# Altium project SmartHome_Switch_noAC.PrjPcb
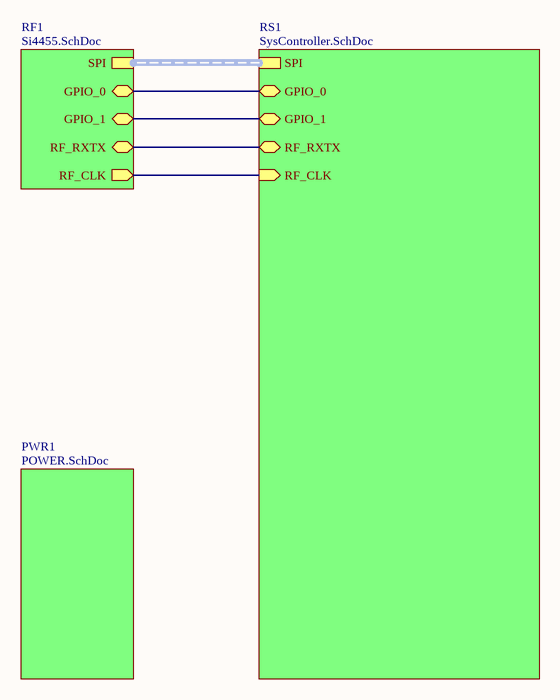
[diagram p0: main.SchDoc]
4 sheets, 74 parts. Net scope: hierarchical (ports join the sheet entries above them; power ports are global).
Board file: SmartHome_Switch.PcbDoc
Sheets:
  main.SchDoc
    PWR1 = POWER.SchDoc
    RS1 = SysController.SchDoc
    RF1 = Si4455.SchDoc

## Sheet main.SchDoc
size 209 x 297 mm; Address1: Address1; Address2: Address2; Address3: Address3; Address4: Address4; DocumentNumber: 1; SheetNumber: 1; SheetTotal: 7; Scale: 1:1; Обозначение документа: АБВГ.123456.001 Э3; Разраб.: Иванов; Пров.: Петров; Утв.: Сидоров; Наименование организации: ОАО "Ваша фирма"; Перв. применение: АБВГ.123456.000; Наименование изделия 1: Плата; Наименование изделия 2: Схема электрическая; Наименование изделия 3: принципиальная; Нач. отд.: Нач. отд.; Фамилия нач. отд.: Сидоров

### Sub-sheets
PWR1 = POWER.SchDoc: no entries
RF1 = Si4455.SchDoc: SPI (harness SPI), RF_RXTX (bidir), RF_CLK (out), GPIO_0 (bidir), GPIO_1 (bidir)
RS1 = SysController.SchDoc: RF_CLK (in), RF_RXTX (bidir), SPI (harness SPI), GPIO_0 (bidir), GPIO_1 (bidir)

### Nets
GPIO_0: sheet RS1/GPIO_0, sheet RF1/GPIO_0
GPIO_1: sheet RS1/GPIO_1, sheet RF1/GPIO_1
RF_CLK: sheet RS1/RF_CLK, sheet RF1/RF_CLK
RF_RXTX: sheet RS1/RF_RXTX, sheet RF1/RF_RXTX

### Buses and harness runs
harness sheet RF1/SPI = sheet RS1/SPI

### Notes on the sheet
- Перв. примен.
- Справ. №
- Подп. и дата
- Инв. № дубл.
- Взам. инв. №
- Разраб.
- Изм.
- Лист
- № докум.
- Подп.
- Дата
- Лит.
- Масса
- Масштаб
- Пров.
- Т.контр.
- Листов
- Инв. № подл.
- Утв.
- Н.контр.
- Копировал
- Формат А4

## Sheet POWER.SchDoc
size 420 x 297 mm; Organization: Altium Limited; Address1: L3, 12a Rodborough Rd; Address2: Frenchs Forest; Address3: NSW; Address4: Australia 2086
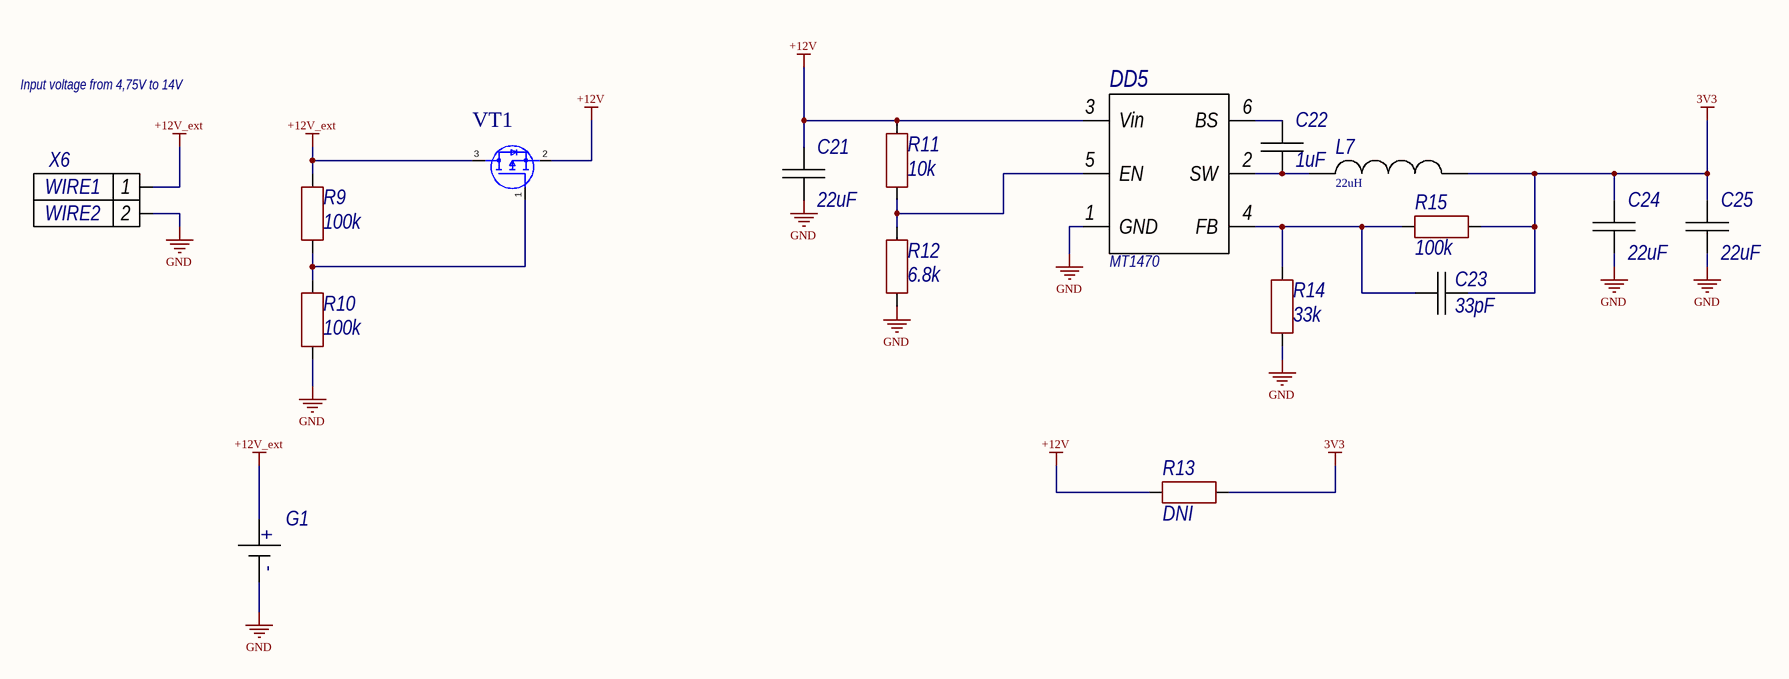
[diagram p1: POWER.SchDoc]

### Parts
C21  value 22uF  [CAPC0805N]  (hidden comment: CAPC0805)
C22  1uF  [CAPC0603N]
C23  33pF  [CAP0402]
C24  value 22uF  [CAPC0805N]  (hidden comment: CAPC0805)
C25  value 22uF  [CAPC0805N]  (hidden comment: CAPC0805)
DD5  MPN: MT1470  [SOT23-6]
G1  C70373  [BAT-SMD_CR2032-3V]  (value not drawn)
L7  22uH  [CAPC0805N]
R9  100k  [RESC0402(1005)_M]
R10  100k  [RESC0402(1005)_M]
R11  10k  [RESC0402(1005)_M]
R12  6.8k  [RESC0402(1005)_M]
R13  DNI  [RESC0603N]
R14  33k  [RESC0402(1005)_M]
R15  100k  [RESC0402(1005)_M]
VT1  AO3401A  [SOT-23]  (value not drawn)
X6  DG500-5.0-02P-14  [DG500-5.0-02P-14]  (value not drawn)

### Nets
3V3: C23.1 C24.2 C25.2 L7.2 R13.2 R15.2
+12V: C21.2 DD5.3(Vin) R11.1 R13.1 VT1.2(S)
+12V_ext: G1.1(+) R9.1 VT1.3(D) X6.1
GND: C21.1 C24.1 C25.1 DD5.1(GND) G1.2(-) R10.2 R12.2 R14.2 X6.2
NetC22_1: C22.1 DD5.2(SW) L7.1
NetC22_2: C22.2 DD5.6(BS)
NetC23_2: C23.2 DD5.4(FB) R14.1 R15.1
NetDD5_5: DD5.5(EN) R11.2 R12.1
NetR9_2: R9.2 R10.1 VT1.1(G)

### Notes on the sheet
- Input voltage from 4,75V to 14V
- Подп. и дата
- Инв.№ дубл.
- Взам.инв.№
- Подп.и дата
- Инв.№ подл.
- Изм.
- Лист
- № докум.
- Подп.
- Дата
- Формат  A3

### Library data of the parts
C21 = CAPC0805: MntType: SMD; Voltage: 25V; MSL: MSL 1; Package: =Footprint; RoHS: Comply; PartType: CHIP CERAMIC CAPACITOR; Pins: 2; BOMDescription: =MntType+' '+PartType+' '+Package+' '+Value+' '+Tolerance+' '+Voltage+' '+TempCoeff+' '+MPN; CFootprint: =Footprint; Part Number: CAPC0805; ClassName: Capacitor; ComponentLink1Description: Datasheet
C22 = CAPC: MntType: SMD; MSL: MSL 1; Package: =Footprint; RoHS: Comply; PartType: CHIP CERAMIC CAPACITOR; Pins: 2; BOMDescription: =MntType+' '+PartType+' '+Package+' '+Value+' '+Tolerance+' '+Voltage+' '+TempCoeff+' '+MPN; CFootprint: =Footprint; Value: 1uF; Part Number: CAPC; ClassName: Capacitor; ComponentLink1Description: Datasheet
C23 = CAP0402: MntType: SMD; BOMDescription: SMD CHIP CERAMIC CAPACITOR C_0402 33pF; MSL: MSL 1; Package: C_0402; RoHS: Comply; PartType: CHIP CERAMIC CAPACITOR; Pins: 2; CFootprint: =Footprint; Value: 33pF; Part Number: CAP0402; ClassName: Capacitor; ComponentLink1Description: Datasheet
C24 C25 = CAPC0805: MntType: SMD; Voltage: 25V; Rule: UNIONINDEX=0|RULEKIND=PolygonConnect|NETSCOPE=AnyNet|LAYERKIND=SameLayer|NAME=Schematic Polygon Connect Style|CONNECTSTYLE=Relief|RELIEFCONDUCTORWIDTH=15.748mil|RELIEFENTRIES=4|POLYGONRELIEFANGLE=90 Angle|AIRGAPWIDTH=10mil|UNIT=Metric; MSL: MSL 1; Package: =Footprint; RoHS: Comply; PartType: CHIP CERAMIC CAPACITOR; Pins: 2; BOMDescription: =MntType+' '+PartType+' '+Package+' '+Value+' '+Tolerance+' '+Voltage+' '+TempCoeff+' '+MPN; CFootprint: =Footprint; Part Number: CAPC0805; ClassName: Capacitor; ComponentLink1Description: Datasheet
DD5 = MT1470: Manufacturer: XI'AN Aerosemi Tech; MntType: SMD; Part Number: MT1470; MSL: MSL 1; Package: SOT23-6; RoHS: Comply; PartType: Buck converter; Pins: 6; BOMDescription: MT1470; CFootprint: =Footprint; ClassName: Buck; ComponentLink1Description: Datasheet; ComponentLink1URL: https://datasheet.lcsc.com/lcsc/2109171430_XI-AN-Aerosemi-Tech-MT1470_C181781.pdf
G1 = C70373: MntType: SMD; Part Number: C70373; MPN: C70373; MSL: MSL 1; RoHS: Comply; PartType: Battery; Pins: 2; BOMDescription: C70373; CFootprint: =Footprint; ClassName: Battery; ComponentLink1Description: Datasheet; ComponentLink1URL: https://datasheet.lcsc.com/lcsc/1810231513_Q&J-C70373_C70373.pdf
L7 = MGFL2012F220MT-LF: Manufacturer: microgate; MntType: SMD; MPN: MGFL2012F220MT-LF; MSL: MSL 1; Package: =Footprint; RoHS: Comply; PartType: INDUCTOR; Pins: 2; BOMDescription: MGFL2012F220MT-LF; CFootprint: =Footprint; Value: 22uH; Part Number: MGFL2012F220MT-LF; ClassName: Inductor; ComponentLink1Description: Datasheet; ComponentLink1URL: https://datasheet.lcsc.com/lcsc/2002201432_microgate-MGFL2012F220MT-LF_C486334.pdf
R9-R12 R14 R15 = RES0402: MntType: SMD; MSL: MSL 1; Package: =Footprint; RoHS: Comply; PartType: CHIP RESISTOR; Pins: 2; BOMDescription: =MntType+' '+PartType+' '+Package+' '+Value+' '+Tolerance+' '+Voltage+' '+TempCoeff+' '+MPN; CFootprint: =Footprint; Part Number: RES0402; ClassName: Resistor; ComponentLink1Description: Datasheet
  R9 R10 R15: Value: 100k
  R11: Value: 10k
  R12: Value: 6.8k
  R14: Value: 33k
R13 = RES: MntType: SMD; MSL: MSL 1; Package: =Footprint; RoHS: Comply; PartType: CHIP RESISTOR; Pins: 2; BOMDescription: =MntType+' '+PartType+' '+Package+' '+Value+' '+Tolerance+' '+Voltage+' '+TempCoeff+' '+MPN; CFootprint: =Footprint; Value: DNI; Part Number: RES; ClassName: Resistor; ComponentLink1Description: Datasheet
VT1 = AO3401A: MntType: SMD; Part Number: AO3401A; MPN: AO3401A; MSL: MSL 1; Package: SOT-23; RoHS: Comply; PartType: P-MOSFET; Pins: 3; BOMDescription: AO3401A; CFootprint: =Footprint; ClassName: MosFET; ComponentLink1Description: Datasheet; ComponentLink1URL: https://datasheet.lcsc.com/lcsc/2007171935_HUASHUO-AO3401A_C700954.pdf
X6 = DG500-5.0-02P-14: MntType: DIP; System: Connector; Rule: UNIONINDEX=0|RULEKIND=PolygonConnect|NETSCOPE=AnyNet|LAYERKIND=SameLayer|NAME=Schematic Polygon Connect Style|CONNECTSTYLE=Relief|RELIEFCONDUCTORWIDTH=19.685mil|RELIEFENTRIES=4|POLYGONRELIEFANGLE=90 Angle|AIRGAPWIDTH=10mil|UNIT=Metric; Wire2: WIRE2; Wire1: WIRE1; Part Number: DG500-5.0-02P-14; Value: DG500-5.0-02P-14; MPN: DG500-5.0-02P-14; MSL: MSL 1; RoHS: Comply; PartType: CONNECTOR; Pins: 2; BOMDescription: =MntType+' '+PartType+' '+Package+' '+Value+' '+Tolerance+' '+Voltage+' '+TempCoeff+' '+MPN; CFootprint: =Footprint; ClassName: Connector; ComponentLink1Description: Datasheet

## Sheet SysController.SchDoc
size 420 x 297 mm; Address1: Address1; Address2: Address2; Address3: Address3; Address4: Address4; DocumentNumber: 5; SheetNumber: 5; SheetTotal: 7; Scale: 1:1; Обозначение документа: АБВГ.123456.001 Э3; Разраб.: Иванов; Пров.: Петров; Утв.: Сидоров; Наименование организации: ОАО "Ваша фирма"; Перв. применение: АБВГ.123456.000; Наименование изделия 1: Плата; Наименование изделия 2: Схема электрическая; Наименование изделия 3: принципиальная; Нач. отд.: Нач. отд.; Фамилия нач. отд.: Сидоров
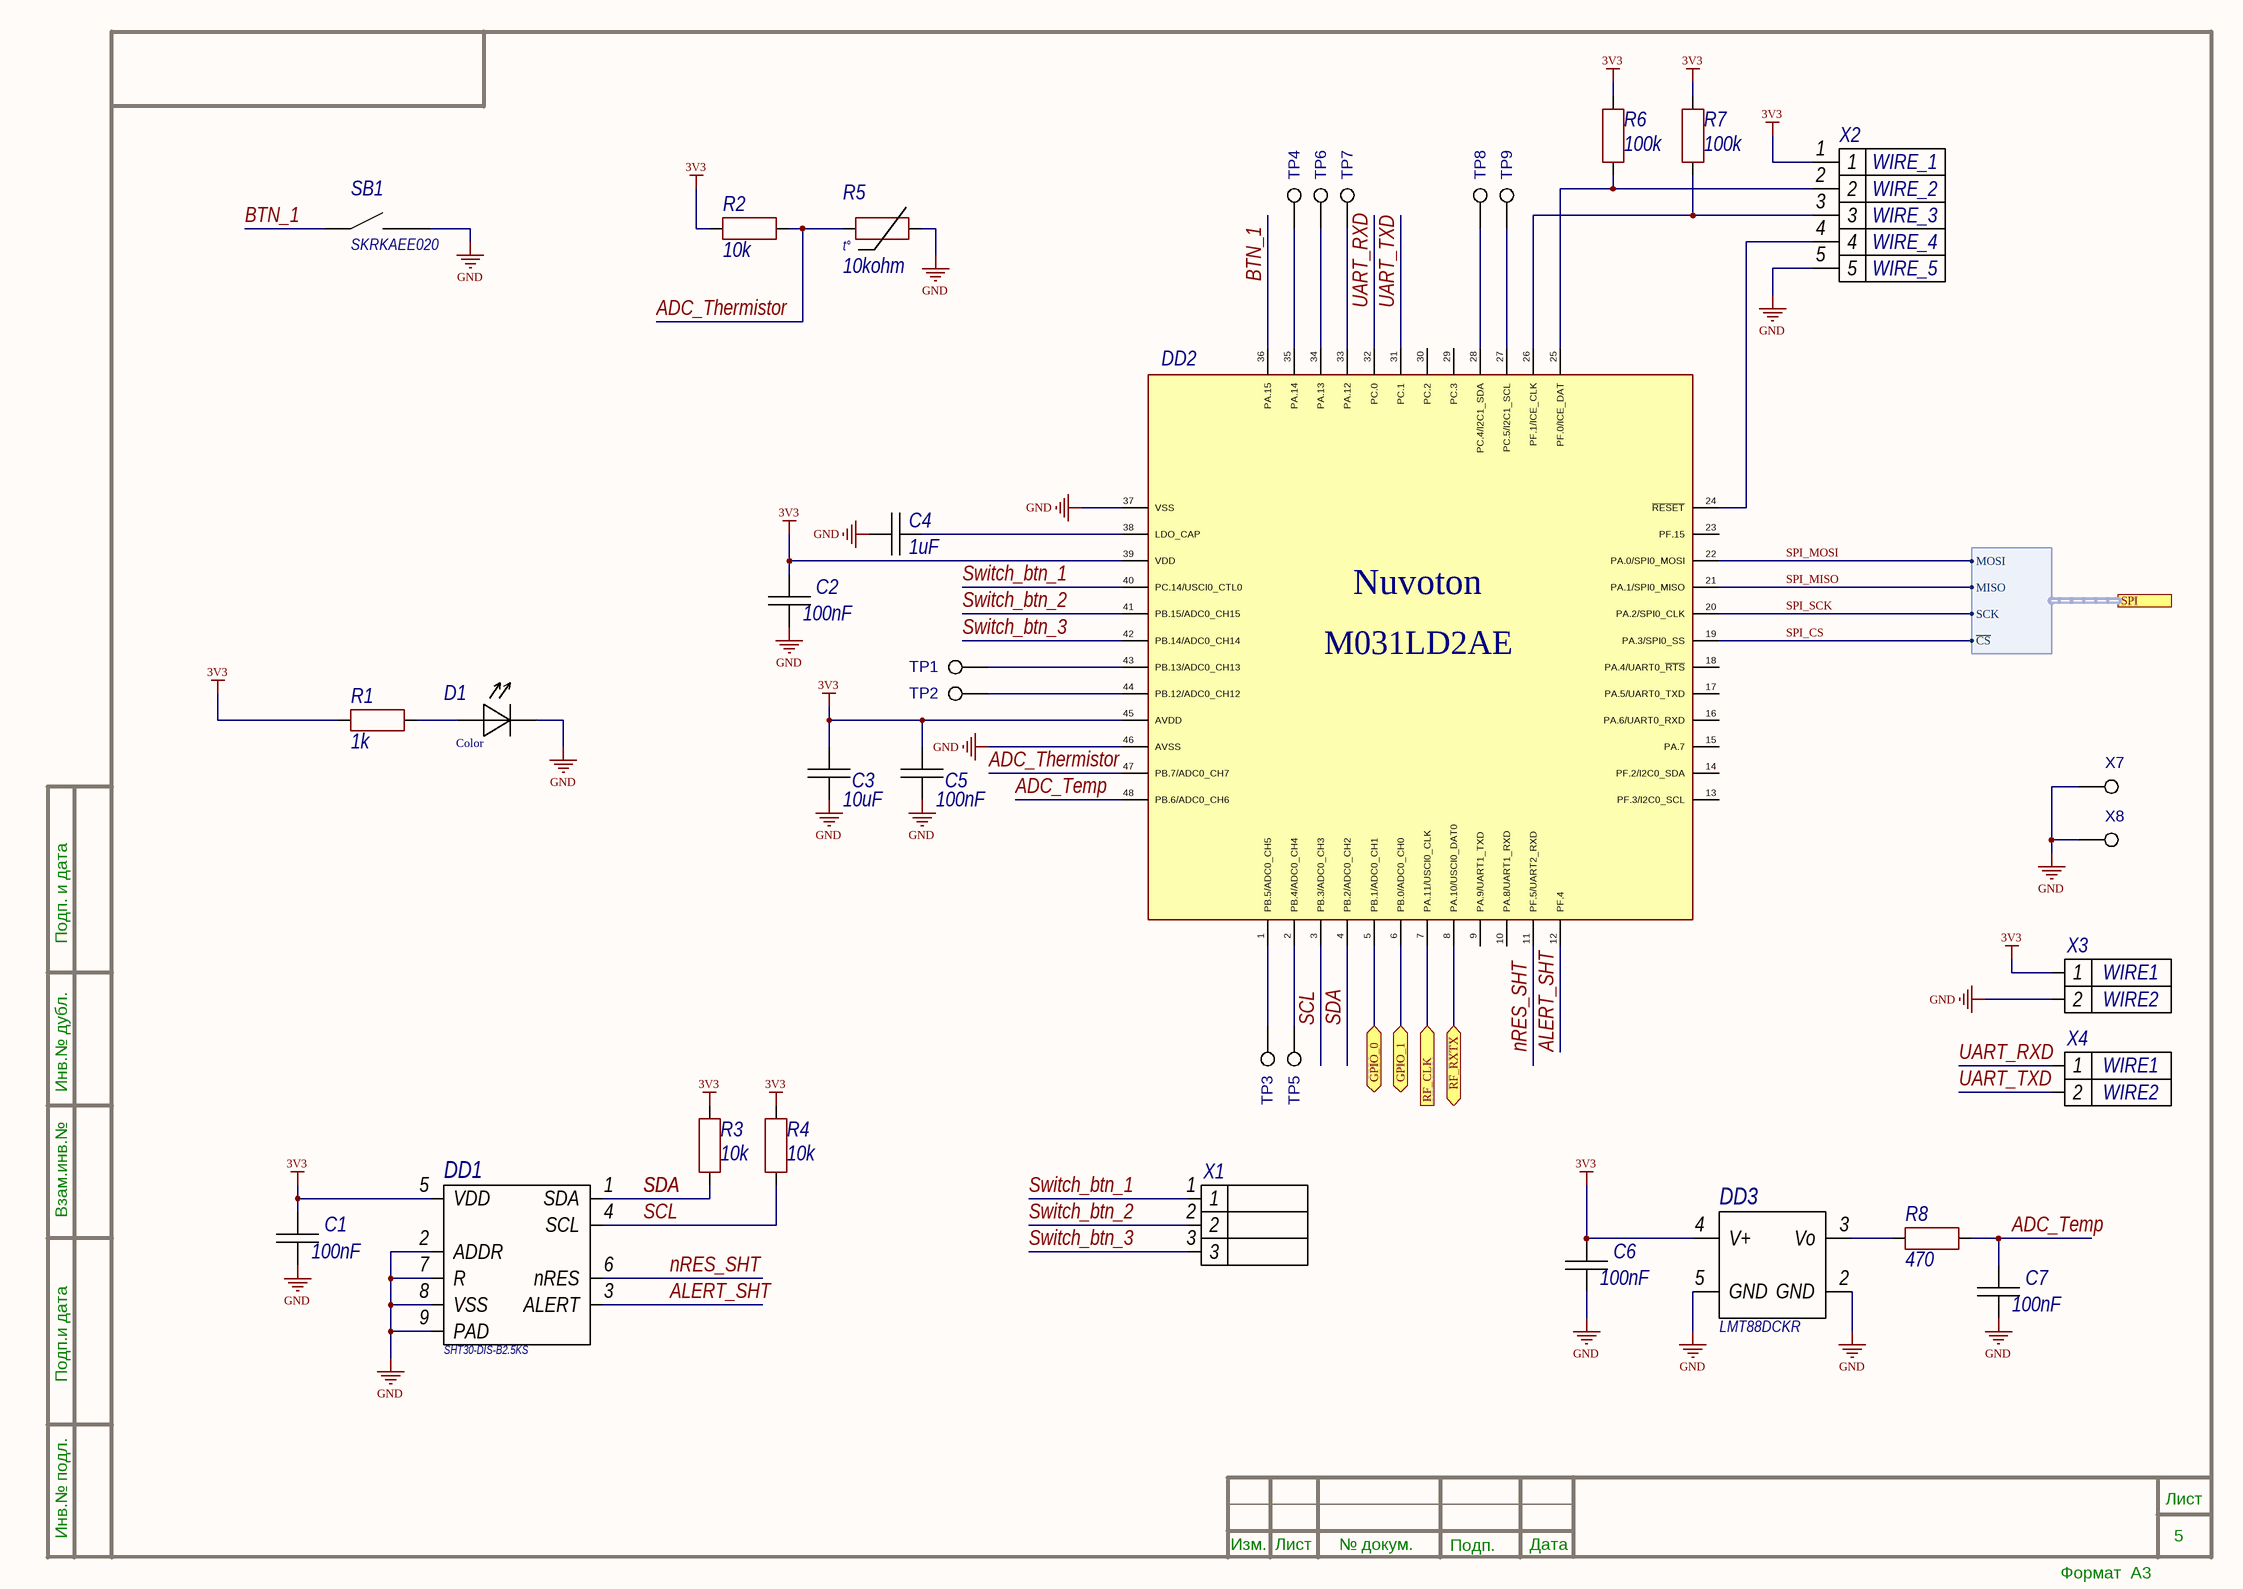
[diagram p2: SysController.SchDoc]

### Parts
C1  100nF  [CAP0402]
C2  100nF  [CAP0402]
C3  10uF  [CAPC0603N]
C4  1uF  [CAPC0603N]
C5  100nF  [CAP0402]
C6  100nF  [CAP0402]
C7  100nF  [CAP0402]
D1  Color  [LED603]
DD1  SHT30-DIS-B2.5KS  [DFN8]
DD2  (no value)  [LQFP48]
DD3  MPN: LMT88DCKR  [SC70-5]
R1  1k  [RESC0402(1005)_M]
R2  10k  [RESC0402(1005)_M]
R3  10k  [RESC0402(1005)_M]
R4  10k  [RESC0402(1005)_M]
R5  value 10kohm  [RESC0805L]
R6  100k  [RESC0402(1005)_M]
R7  100k  [RESC0402(1005)_M]
R8  470  [RESC0402(1005)_M]
SB1  MPN: SKRKAEE020  [SW_SKRKAEE020]  (hidden comment: DTSM-3)
TP1  TP-SINGLE-ROUND  [TP-ROUND-TOP-1.5]  (value not drawn)
TP2  TP-SINGLE-ROUND  [TP-ROUND-TOP-1.5]  (value not drawn)
TP3  TP-SINGLE-ROUND  [TP-ROUND-TOP-1.5]  (value not drawn)
TP4  TP-SINGLE-ROUND  [TP-ROUND-TOP-1.5]  (value not drawn)
TP5  TP-SINGLE-ROUND  [TP-ROUND-TOP-1.5]  (value not drawn)
TP6  TP-SINGLE-ROUND  [TP-ROUND-TOP-1.5]  (value not drawn)
TP7  TP-SINGLE-ROUND  [TP-ROUND-TOP-1.5]  (value not drawn)
TP8  TP-SINGLE-ROUND  [TP-ROUND-TOP-1.5]  (value not drawn)
TP9  TP-SINGLE-ROUND  [TP-ROUND-TOP-1.5]  (value not drawn)
X1  PLS-3  [SmartHome_for_switch]  (value not drawn)
X2  Wire5: WIRE_5  Wire4: WIRE_4  Wire3: WIRE_3  Wire2: WIRE_2  Wire1: WIRE_1  [PLS5]  (hidden comment: PLS5)
X3  DG350-3.5-02P-14-00A  [Conn_3,5mm_2pin]  (value not drawn)
X4  DG350-3.5-02P-14-00A  [Conn_3,5mm_2pin]  (value not drawn)
X7  PLS1  [PLS1]  (value not drawn)  (no BOM)
X8  PLS1  [PLS1]  (value not drawn)  (no BOM)

### Ports
GPIO_0 (bidir), GPIO_1 (bidir), RF_CLK (in), RF_RXTX (bidir), SPI (harness SPI)

### Harnesses
SPI: SCK, MOSI, MISO, ~{CS}

### Nets
3V3: C1.2 C2.2 C3.1 C5.2 C6.2 DD1.5(VDD) DD2.39(VDD) DD2.45(AVDD) DD3.4(V+) R1.1 R2.1 R3.2 R4.2 R6.2 R7.2 X2.1 X3.1
GND: C1.1 C2.1 C3.2 C4.1 C5.1 C6.1 C7.1 D1.1(A) DD1.2(ADDR) DD1.7(R) DD1.8(VSS) DD1.9(PAD) DD2.37(VSS) DD2.46(AVSS) DD3.2(GND) DD3.5(GND) R5.2 SB1.1 X2.5 X3.2 X7.1 X8.1
ADC_Temp: C7.2 DD2.48(PB.6/ADC0_CH6) R8.2  [project net ADC_Temp_5]
ADC_Thermistor: DD2.47(PB.7/ADC0_CH7) R2.2 R5.1  [project net ADC_Thermistor_5]
ALERT_SHT: DD1.3(ALERT) DD2.12(PF.4)  [project net ALERT_SHT_5]
BTN_1: DD2.36(PA.15) SB1.2  [project net BTN_1_5]
GPIO_0: DD2.5(PB.1/ADC0_CH1) ; port GPIO_0
GPIO_1: DD2.6(PB.0/ADC0_CH0) ; port GPIO_1
nRES_SHT: DD1.6(nRES) DD2.11(PF.5/UART2_RXD)  [project net nRES_SHT_5]
RF_CLK: DD2.7(PA.11/USCI0_CLK) ; port RF_CLK
RF_RXTX: DD2.8(PA.10/USCI0_DAT0) ; port RF_RXTX
SCL: DD1.4(SCL) DD2.3(PB.3/ADC0_CH3) R4.1  [project net SCL_5]
SDA: DD1.1(SDA) DD2.4(PB.2/ADC0_CH2) R3.1  [project net SDA_5]
SPI_CS: DD2.19(PA.3/SPI0_SS) ; port SPI.~{CS}
SPI_MISO: DD2.21(PA.1/SPI0_MISO) ; port SPI.MISO
SPI_MOSI: DD2.22(PA.0/SPI0_MOSI) ; port SPI.MOSI
SPI_SCK: DD2.20(PA.2/SPI0_CLK) ; port SPI.SCK
Switch_btn_1: DD2.40(PC.14/USCI0_CTL0) X1.1  [project net Switch_btn_1_5]
Switch_btn_2: DD2.41(PB.15/ADC0_CH15) X1.2  [project net Switch_btn_2_5]
Switch_btn_3: DD2.42(PB.14/ADC0_CH14) X1.3  [project net Switch_btn_3_5]
UART_RXD: DD2.32(PC.0) X4.1  [project net UART_RXD_5]
UART_TXD: DD2.31(PC.1) X4.2  [project net UART_TXD_5]
NetC4_2: C4.2 DD2.38(LDO_CAP)
NetD1_2: D1.2(K) R1.2
NetDD2_1: DD2.1(PB.5/ADC0_CH5) TP3.1
NetDD2_2: DD2.2(PB.4/ADC0_CH4) TP5.1
NetDD2_24: DD2.24(~{RESET}) X2.4
NetDD2_25: DD2.25(PF.0/ICE_DAT) R6.1 X2.2
NetDD2_26: DD2.26(PF.1/ICE_CLK) R7.1 X2.3
NetDD2_27: DD2.27(PC.5/I2C1_SCL) TP9.1
NetDD2_28: DD2.28(PC.4/I2C1_SDA) TP8.1
NetDD2_33: DD2.33(PA.12) TP7.1
NetDD2_34: DD2.34(PA.13) TP6.1
NetDD2_35: DD2.35(PA.14) TP4.1
NetDD2_43: DD2.43(PB.13/ADC0_CH13) TP1.1
NetDD2_44: DD2.44(PB.12/ADC0_CH12) TP2.1
NetDD3_3: DD3.3(Vo) R8.1

Not connected (* = marked no-connect by the designer): DD2 9(PA.9/UART1_TXD) 10(PA.8/UART1_RXD) 13(PF.3/I2C0_SCL) 14(PF.2/I2C0_SDA) 15(PA.7) 16(PA.6/UART0_RXD) 17(PA.5/UART0_TXD) 18(PA.4/UART0_~{RTS}) 23(PF.15) 29(PC.3) 30(PC.2)

### Notes on the sheet
- Подп. и дата
- Инв.№ дубл.
- Взам.инв.№
- Подп.и дата
- Инв.№ подл.
- Изм.
- Лист
- № докум.
- Подп.
- Дата
- Формат  A3
- (in symbol SDNT2012X103F3950FTF) t°

### Library data of the parts
C1 C2 C5-C7 = CAP0402: MntType: SMD; BOMDescription: SMD CHIP CERAMIC CAPACITOR C_0402 100nF; MSL: MSL 1; Package: C_0402; RoHS: Comply; PartType: CHIP CERAMIC CAPACITOR; Pins: 2; CFootprint: =Footprint; Value: 100nF; Part Number: CAP0402; ClassName: Capacitor; ComponentLink1Description: Datasheet
C3 C4 = CAPC: MntType: SMD; MSL: MSL 1; Package: =Footprint; RoHS: Comply; PartType: CHIP CERAMIC CAPACITOR; Pins: 2; BOMDescription: =MntType+' '+PartType+' '+Package+' '+Value+' '+Tolerance+' '+Voltage+' '+TempCoeff+' '+MPN; CFootprint: =Footprint; Part Number: CAPC; ClassName: Capacitor; ComponentLink1Description: Datasheet
  C3: Value: 10uF
  C4: Value: 1uF
D1 = LEDC: MntType: SMD; MSL: MSL 5; Package: LED603; RoHS: Comply; PartType: CHIP LED; Pins: 2; BOMDescription: =MntType+' '+PartType+' '+Package+' '+Value+' '+Tolerance+' '+Voltage+' '+TempCoeff+' '+MPN; CFootprint: LED603; Value: Color; Part Number: LEDC; ClassName: LED; ComponentLink1Description: Datasheet
DD1 = SHT30-DIS-B2.5KS: Manufacturer: SENSIRION; MntType: SMD; MPN: SHT30-DIS-B2.5KS; Part Number: SHT30-DIS-B2.5KS; MSL: MSL 1; Package: DFN8; RoHS: Comply; PartType: Sensor temp and humidity; Pins: 9; BOMDescription: SHT30-DIS-B2.5KS; CFootprint: =Footprint; ClassName: Sensor; ComponentLink1Description: Datasheet; ComponentLink1URL: https://datasheet.lcsc.com/lcsc/2012111104_Sensirion-SHT30-DIS-B2-5KS_C77361.pdf
DD2 = M031LD2AE: Manufacturer: Nuvoton; MntType: SMD; Part Number: M031LD2AE; MPN: M031LD2AE; MSL: MSL 1; Package: LQFP48; RoHS: Comply; PartType: MCU; Pins: 48; BOMDescription: M031LD2AE; CFootprint: =Footprint; ClassName: MCU; ComponentLink1Description: Datasheet; ComponentLink1URL: https://www.nuvoton.com/products/microcontrollers/arm-cortex-m0-mcus/m031-series/m031ld2ae/?group=Document&tab=2
DD3 = LMT88DCKR: Manufacturer: TI; MntType: SMD; Part Number: LMT88DCKR; MSL: MSL 1; Package: SC70; RoHS: Comply; PartType: Temperature sensor; Pins: 5; BOMDescription: LMT88DCKR; CFootprint: =Footprint; ClassName: Temperature sensor; ComponentLink1Description: Datasheet; ComponentLink1URL: https://www.ti.com/lit/ds/symlink/lmt88.pdf?ts=1635229688804&ref_url=https%253A%252F%252Fwww.ti.com%252Fproduct%252FLMT88%253Fqgpn%253Dlmt88
R1-R4 R6-R8 = RES0402: MntType: SMD; MSL: MSL 1; Package: =Footprint; RoHS: Comply; PartType: CHIP RESISTOR; Pins: 2; BOMDescription: =MntType+' '+PartType+' '+Package+' '+Value+' '+Tolerance+' '+Voltage+' '+TempCoeff+' '+MPN; CFootprint: =Footprint; Part Number: RES0402; ClassName: Resistor; ComponentLink1Description: Datasheet
  R1: Value: 1k
  R2-R4: Value: 10k
  R6 R7: Value: 100k
  R8: Value: 470
R5 = SDNT2012X103F3950FTF: Manufacturer: Sunlord; MntType: SMD; Part Number: SDNT2012X103F3950FTF; MPN: SDNT2012X103F3950FTF; MSL: MSL 1; Package: =Footprint; RoHS: Comply; PartType: Thermistor; Pins: 2; BOMDescription: SDNT2012X103F3950FTF; CFootprint: =Footprint; ClassName: Thermistor; ComponentLink1Description: Datasheet; ComponentLink1URL: https://datasheet.lcsc.com/lcsc/1811111111_Sunlord-SDNT2012X103F3950FTF_C95968.pdf
SB1 = SKRKAEE020: MntType: SMD; Part Number: SKRKAEE020; MSL: MSL 1; RoHS: Comply; PartType: BUTTON; Pins: 2; BOMDescription: SKRKAEE020; CFootprint: =Footprint; ClassName: Button; ComponentLink1Description: Datasheet; ComponentLink1URL: https://datasheet.lcsc.com/lcsc/1809201020_ALPSALPINE-SKRKAEE020_C115357.pdf
TP1-TP9 = TP-SINGLE-ROUND: MntType: SMD; MSL: MSL 1; RoHS: Comply; BOMDescription: SMD; CFootprint: =Footprint; Part Number: TP-SINGLE-ROUND; ClassName: Touch; ComponentLink1Description: Datasheet
X1 = SmartHome_for_switch: MntType: DIP; Part Number: SmartHome_for_switch; Value: PLS-3; MPN: PLS-3; MSL: MSL 1; RoHS: Comply; PartType: CONNECTOR; Pins: 3; BOMDescription: PLS-3; CFootprint: =Footprint; ClassName: Connector
X2 = PLS5: MntType: DIP; BOMDescription: DIP CONNECTOR CONNPLS5     PLS5; System: Connector; MPN: PLS5; MSL: MSL 1; Package: CONNPLS5; RoHS: Comply; PartType: CONNECTOR; Pins: 5; CFootprint: PLS5; Part Number: PLS5; ClassName: Connector; ComponentLink1Description: Datasheet
X3 X4 = DG350-3.5-02P-14-00A: MntType: DIP; System: Connector; Wire2: WIRE2; Wire1: WIRE1; Part Number: DG350-3.5-02P-14-00A; MPN: DG350-3.5-02P-14-00A; MSL: MSL 1; RoHS: Comply; PartType: CONNECTOR; Pins: 2; BOMDescription: DG350-3.5-02P-14-00A; CFootprint: =Footprint; ClassName: Connector; ComponentLink1Description: Datasheet; ComponentLink1URL: https://datasheet.lcsc.com/lcsc/2106062140_DEGSON-DG350-3.5-02P-14-00A-H_C2760668.pdf
X7 X8 = Test_PLS1: MntType: DIP; BOMDescription: DIP PLS; System: Connector; MSL: MSL 1; RoHS: Comply; PartType: PLS; Pins: 1; CFootprint: =Footprint; Part Number: Test_PLS1; ClassName: Test_Point; ComponentLink1Description: Datasheet

## Sheet Si4455.SchDoc
size 420 x 297 mm; Address1: Address1; Address2: Address2; Address3: Address3; Address4: Address4; DocumentNumber: 7; SheetNumber: 7; SheetTotal: 7; Scale: 1:1; Обозначение документа: АБВГ.123456.001 Э3; Разраб.: Иванов; Пров.: Петров; Утв.: Сидоров; Наименование организации: ОАО "Ваша фирма"; Перв. применение: АБВГ.123456.000; Наименование изделия 1: Плата; Наименование изделия 2: Схема электрическая; Наименование изделия 3: принципиальная; Нач. отд.: Нач. отд.; Фамилия нач. отд.: Сидоров
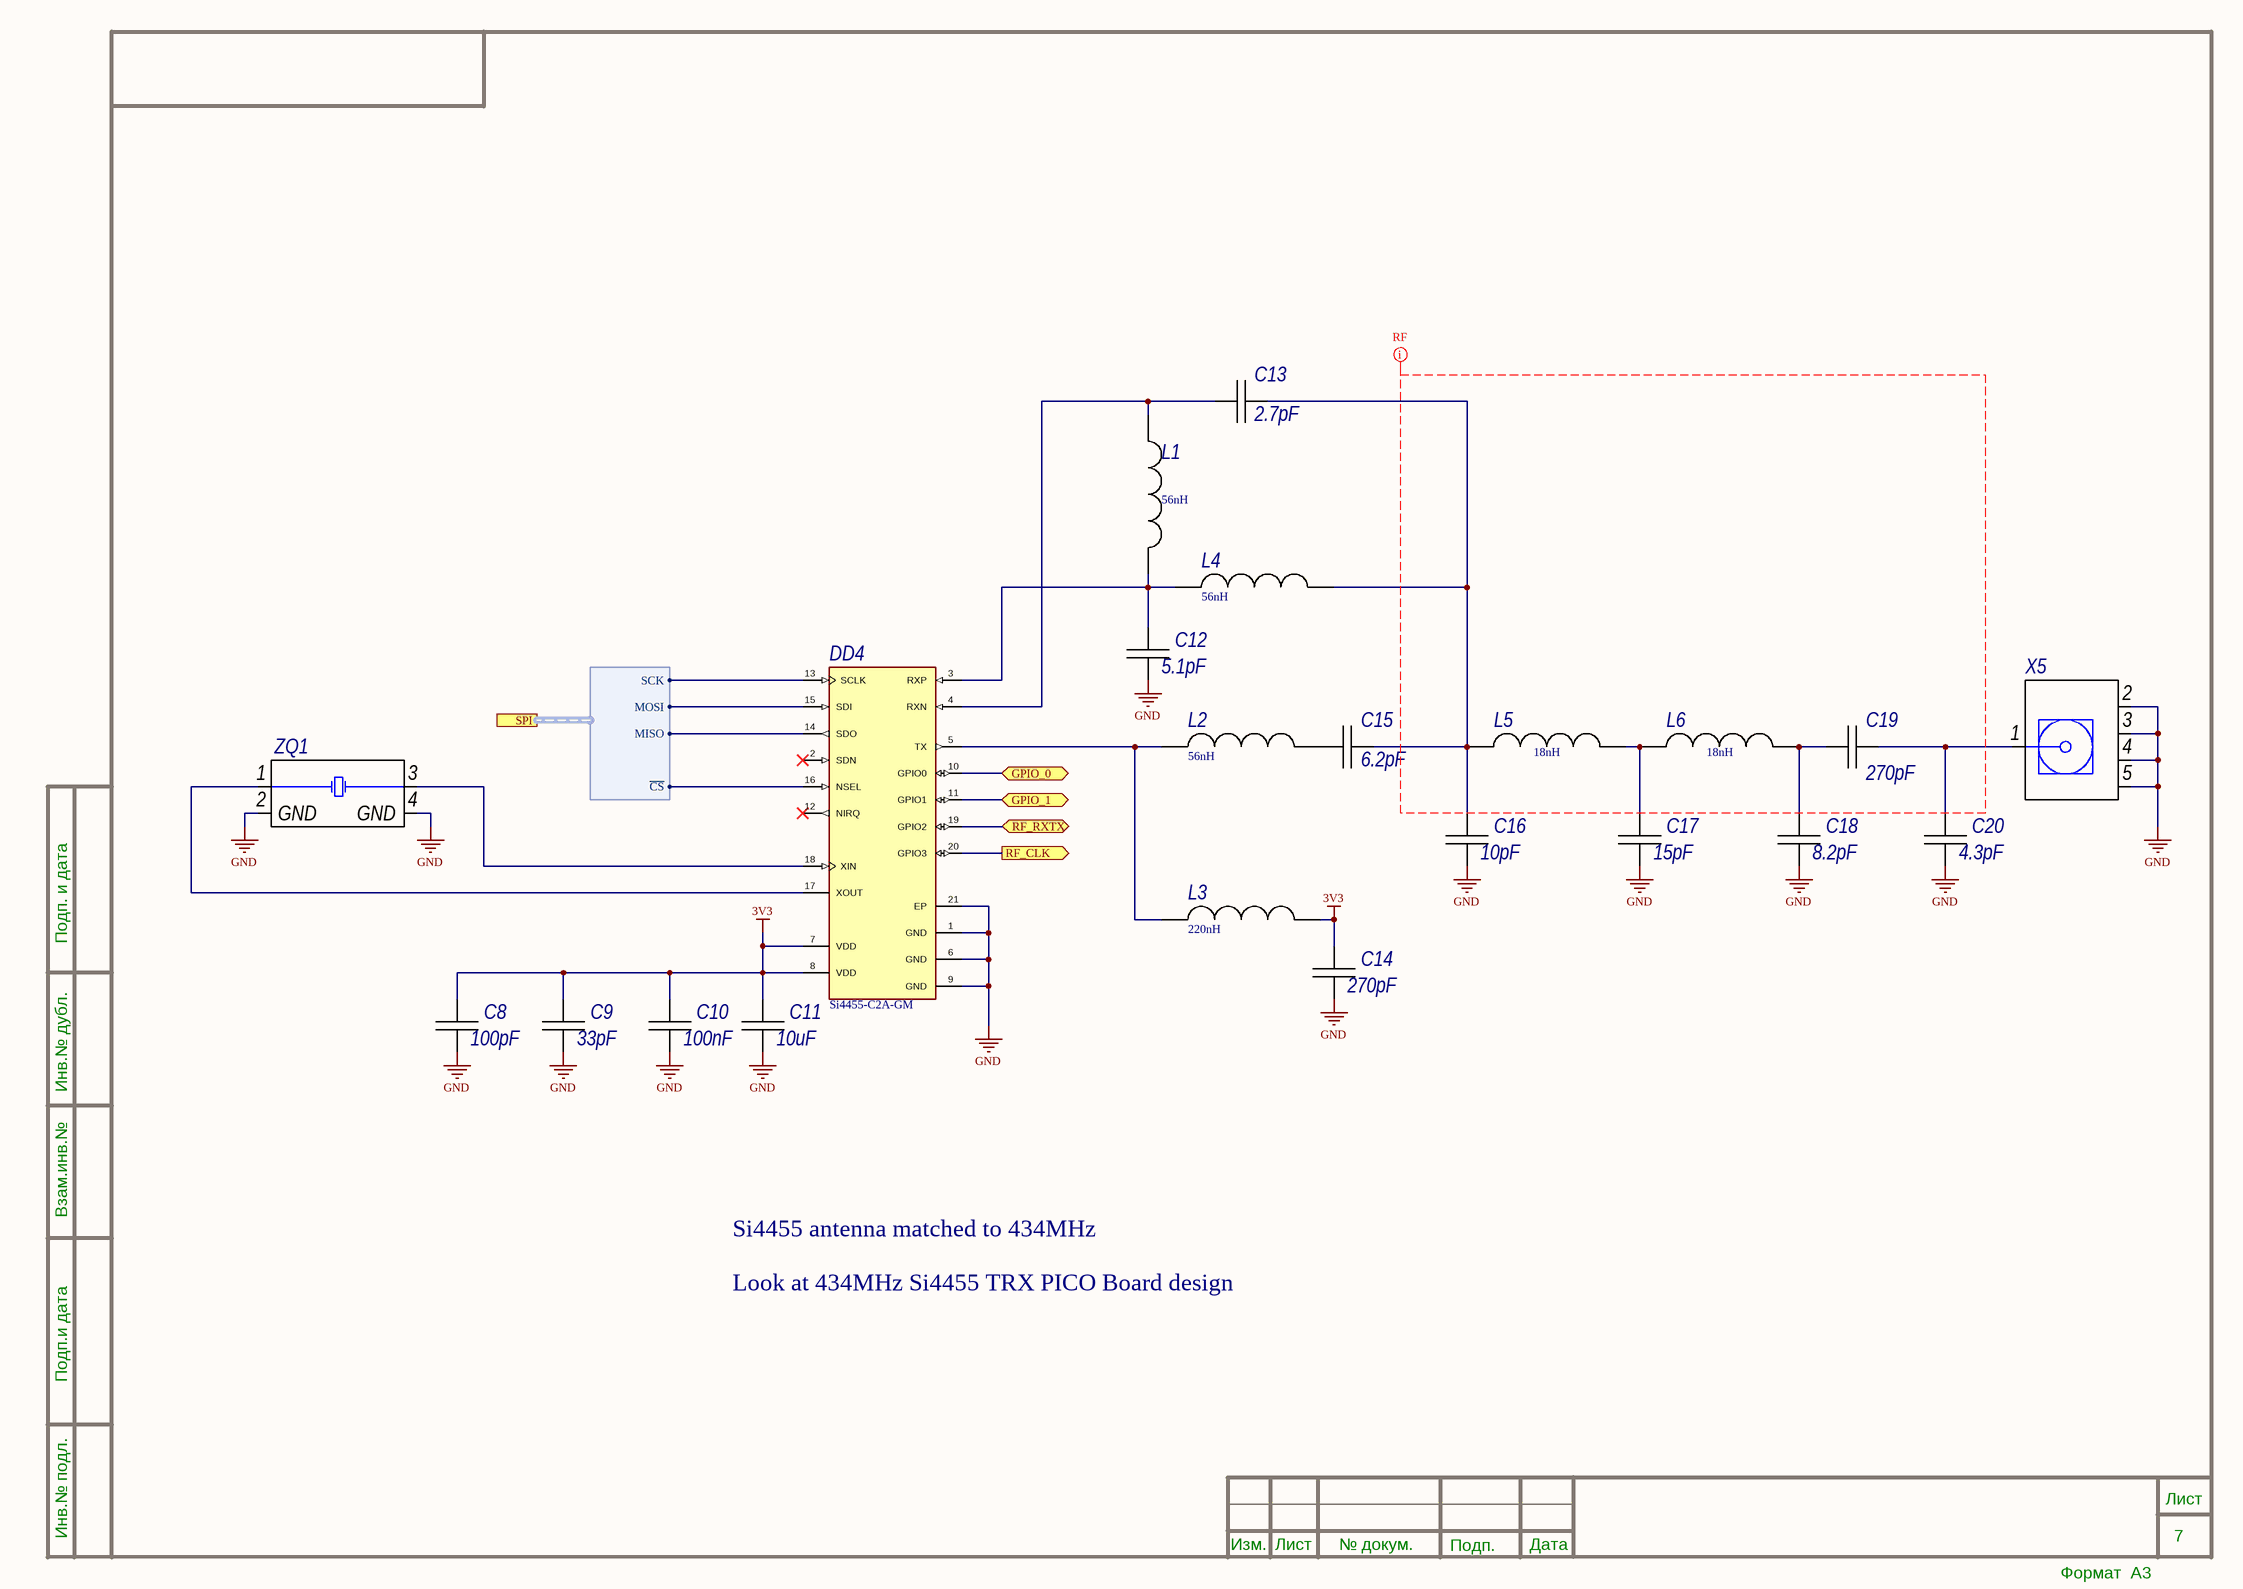
[diagram p3: Si4455.SchDoc]

### Parts
C8  100pF  [CAP0402]
C9  33pF  [CAP0402]
C10  100nF  [CAP0402]
C11  10uF  [CAPC0603N]
C12  5.1pF  [CAP0402]
C13  2.7pF  [CAP0402]
C14  270pF  [CAP0402]
C15  6.2pF  [CAP0402]
C16  10pF  [CAP0402]
C17  15pF  [CAP0402]
C18  8.2pF  [CAP0402]
C19  270pF  [CAP0402]
C20  4.3pF  [CAP0402]
DD4  Si4455-С2A-GM  [SLAB-QFN-20]
L1  56nH  [RESC0402(1005)_M]
L2  56nH  [RESC0402(1005)_M]
L3  220nH  [RESC0402(1005)_M]
L4  56nH  [RESC0402(1005)_M]
L5  18nH  [RESC0402(1005)_M]
L6  18nH  [RESC0402(1005)_M]
X5  (no value)  [60311042114502]
ZQ1  X322525MOB4SI  [TSX-3225_V]  (value not drawn)

### Ports
GPIO_0 (bidir), GPIO_1 (bidir), RF_CLK (out), RF_RXTX (bidir), SPI (harness SPI)

### Harnesses
SPI: SCK, MOSI, MISO, ~{CS}

### Nets
3V3: C8.2 C9.2 C10.2 C11.1 C14.1 DD4.7(VDD) DD4.8(VDD) L3.2
GND: C8.1 C9.1 C10.1 C11.2 C12.2 C14.2 C16.2 C17.2 C18.2 C20.2 DD4.1(GND) DD4.6(GND) DD4.9(GND) DD4.21(EP) X5.2(GND) X5.3(GND) X5.4(GND) X5.5(GND) ZQ1.2(GND) ZQ1.4(GND)
GPIO_0: DD4.10(GPIO0) ; port GPIO_0
GPIO_1: DD4.11(GPIO1) ; port GPIO_1
RF_CLK: DD4.20(GPIO3) ; port RF_CLK
RF_RXTX: DD4.19(GPIO2) ; port RF_RXTX
SPI_CS: DD4.16(NSEL) ; port SPI.~{CS}
SPI_MISO: DD4.14(SDO) ; port SPI.MISO
SPI_MOSI: DD4.15(SDI) ; port SPI.MOSI
SPI_SCK: DD4.13(SCLK) ; port SPI.SCK
NetC12_1: C12.1 DD4.3(RXP) L1.2 L4.1
NetC13_1: C13.1 C15.1 C16.1 L4.2 L5.1
NetC13_2: C13.2 DD4.4(RXN) L1.1
NetC15_2: C15.2 L2.2
NetC17_1: C17.1 L5.2 L6.1
NetC18_1: C18.1 C19.1 L6.2
NetC19_2: C19.2 C20.1 X5.1(Signal)
NetDD4_5: DD4.5(TX) L2.1 L3.1
NetDD4_17: DD4.17(XOUT) ZQ1.1(X1)
NetDD4_18: DD4.18(XIN) ZQ1.3(X2)

Not connected (* = marked no-connect by the designer): DD4 2(SDN)* 12(NIRQ)*

### Layout directives
net class RF_50ohm; rule Width Constraint [Pref Impedance = 50,00ohms    Min Impedance = 50,00ohms    Max Impedance = 50,00ohms]: (no net found under the mark)

### Notes on the sheet
- Si4455 antenna matched to 434MHz
- Look at 434MHz Si4455 TRX PICO Board design
- Подп. и дата
- Инв.№ дубл.
- Взам.инв.№
- Подп.и дата
- Инв.№ подл.
- Изм.
- Лист
- № докум.
- Подп.
- Дата
- Формат  A3

### Library data of the parts
C8 = CAP0402: MntType: SMD; BOMDescription: SMD CHIP CERAMIC CAPACITOR C_0402 100pF; MSL: MSL 1; Package: C_0402; RoHS: Comply; PartType: CHIP CERAMIC CAPACITOR; Pins: 2; CFootprint: =Footprint; Value: 100pF; Part Number: CAP0402; ClassName: Capacitor; ComponentLink1Description: Datasheet
C9 = CAP0402: as C23 on sheet POWER; MSL: MSL 1; Package: C_0402; RoHS: Comply; PartType: CHIP CERAMIC CAPACITOR; Pins: 2; CFootprint: =Footprint; Value: 33pF; Part Number: CAP0402; ClassName: Capacitor; ComponentLink1Description: Datasheet
C10 = CAP0402: as C1 on sheet SysController; MSL: MSL 1; Package: C_0402; RoHS: Comply; PartType: CHIP CERAMIC CAPACITOR; Pins: 2; CFootprint: =Footprint; Value: 100nF; Part Number: CAP0402; ClassName: Capacitor; ComponentLink1Description: Datasheet
C11 = CAPC: MntType: SMD; MSL: MSL 1; Package: =Footprint; RoHS: Comply; PartType: CHIP CERAMIC CAPACITOR; Pins: 2; BOMDescription: =MntType+' '+PartType+' '+Package+' '+Value+' '+Tolerance+' '+Voltage+' '+TempCoeff+' '+MPN; CFootprint: =Footprint; Value: 10uF; Part Number: CAPC; ClassName: Capacitor; ComponentLink1Description: Datasheet
C12 = CAP0402: MntType: SMD; BOMDescription: SMD CHIP CERAMIC CAPACITOR C_0402 5.1pF; MSL: MSL 1; Package: C_0402; RoHS: Comply; PartType: CHIP CERAMIC CAPACITOR; Pins: 2; CFootprint: =Footprint; Value: 5.1pF; Part Number: CAP0402; ClassName: Capacitor; ComponentLink1Description: Datasheet
C13 = CAP0402: MntType: SMD; BOMDescription: SMD CHIP CERAMIC CAPACITOR C_0402 2.7pF; MSL: MSL 1; Package: C_0402; RoHS: Comply; PartType: CHIP CERAMIC CAPACITOR; Pins: 2; CFootprint: =Footprint; Value: 2.7pF; Part Number: CAP0402; ClassName: Capacitor; ComponentLink1Description: Datasheet
C14 C19 = CAP0402: MntType: SMD; BOMDescription: SMD CHIP CERAMIC CAPACITOR C_0402 270pF; MSL: MSL 1; Package: C_0402; RoHS: Comply; PartType: CHIP CERAMIC CAPACITOR; Pins: 2; CFootprint: =Footprint; Value: 270pF; Part Number: CAP0402; ClassName: Capacitor; ComponentLink1Description: Datasheet
C15 = CAP0402: MntType: SMD; BOMDescription: SMD CHIP CERAMIC CAPACITOR C_0402 6.2pF; MSL: MSL 1; Package: C_0402; RoHS: Comply; PartType: CHIP CERAMIC CAPACITOR; Pins: 2; CFootprint: =Footprint; Value: 6.2pF; Part Number: CAP0402; ClassName: Capacitor; ComponentLink1Description: Datasheet
C16 = CAP0402: MntType: SMD; BOMDescription: SMD CHIP CERAMIC CAPACITOR C_0402 10pF; MSL: MSL 1; Package: C_0402; RoHS: Comply; PartType: CHIP CERAMIC CAPACITOR; Pins: 2; CFootprint: =Footprint; Value: 10pF; Part Number: CAP0402; ClassName: Capacitor; ComponentLink1Description: Datasheet
C17 = CAP0402: MntType: SMD; BOMDescription: SMD CHIP CERAMIC CAPACITOR C_0402 15pF; MSL: MSL 1; Package: C_0402; RoHS: Comply; PartType: CHIP CERAMIC CAPACITOR; Pins: 2; CFootprint: =Footprint; Value: 15pF; Part Number: CAP0402; ClassName: Capacitor; ComponentLink1Description: Datasheet
C18 = CAP0402: MntType: SMD; BOMDescription: SMD CHIP CERAMIC CAPACITOR C_0402 8.2pF; MSL: MSL 1; Package: C_0402; RoHS: Comply; PartType: CHIP CERAMIC CAPACITOR; Pins: 2; CFootprint: =Footprint; Value: 8.2pF; Part Number: CAP0402; ClassName: Capacitor; ComponentLink1Description: Datasheet
C20 = CAP0402: MntType: SMD; BOMDescription: SMD CHIP CERAMIC CAPACITOR C_0402 4.3pF; MSL: MSL 1; Package: C_0402; RoHS: Comply; PartType: CHIP CERAMIC CAPACITOR; Pins: 2; CFootprint: =Footprint; Value: 4.3pF; Part Number: CAP0402; ClassName: Capacitor; ComponentLink1Description: Datasheet
DD4 = Si4455-С2A-GM: Manufacturer: SiLabs; MntType: SMD; ComponentLink1URL: https://www.silabs.com/documents/public/data-sheets/Si4455.pdf; ComponentLink1Description: Datasheet; Part Number: Si4455-С2A-GM; MPN: Si4455-С2A-GM; MSL: MSL 1; Package: QFN20; RoHS: Comply; PartType: RF; Pins: 21; BOMDescription: Si4455-С2A-GM; CFootprint: =Footprint; ClassName: RF
L1-L6 = Inductor_SMD: Manufacturer: TDK; MPN: MLF2012; MntType: SMD; MSL: MSL 1; Package: RESC0402(1005)_M; RoHS: Comply; PartType: INDUCTOR; Pins: 2; BOMDescription: =MntType+' '+PartType+' '+Package+' '+Value+' '+Tolerance+' '+Voltage+' '+TempCoeff+' '+MPN; CFootprint: RESC0402(1005)_M; Part Number: Inductor_SMD; ClassName: Inductor; ComponentLink1Description: Datasheet
  L1 L2 L4: Value: 56nH
  L3: Value: 220nH
  L5 L6: Value: 18nH
X5 = SMA_WR_60311042114502: Manufacturer: WE; MntType: SMD; Part Number: SMA_WR_60311042114502; MPN: 60311042114502; MSL: MSL 1; RoHS: Comply; PartType: SMA; Pins: 5; BOMDescription: =MntType+' '+PartType+' '+Package+' '+Value+' '+Tolerance+' '+Voltage+' '+TempCoeff+' '+MPN; CFootprint: 60311042114502; ClassName: SMA; ComponentLink1Description: Datasheet; ComponentLink1URL: https://katalog.we-online.de/em/datasheet/60311042114502.pdf
ZQ1 = X322525MOB4SI: Manufacturer: Yangxing Tech; MntType: SMD; BOMDescription: SMD XTAL X322525MOB4SI; Part Number: X322525MOB4SI; Value: X322525MOB4SI; MPN: X322525MOB4SI; MSL: MSL 1; RoHS: Comply; PartType: XTAL; Pins: 4; CFootprint: TSX-3225_V; ClassName: XTAL; ComponentLink1Description: Datasheet; ComponentLink1URL: https://datasheet.lcsc.com/szlcsc/Yangxing-Tech-X322525MOB4SI_C9006.pdf

## Nets that join several sheets
3V3: POWER (6 pins), SysController (17 pins), Si4455 (8 pins)
GND: POWER (9 pins), SysController (22 pins), Si4455 (20 pins)
GPIO_0: SysController (DD2.5), Si4455 (DD4.10)
GPIO_1: SysController (DD2.6), Si4455 (DD4.11)
RF_CLK: SysController (DD2.7), Si4455 (DD4.20)
RF_RXTX: SysController (DD2.8), Si4455 (DD4.19)
SPI_CS: SysController (DD2.19), Si4455 (DD4.16)
SPI_MISO: SysController (DD2.21), Si4455 (DD4.14)
SPI_MOSI: SysController (DD2.22), Si4455 (DD4.15)
SPI_SCK: SysController (DD2.20), Si4455 (DD4.13)

## Assembly variants
Battery: not fitted C23 C24 C25 C26 C27 DD5 L7 R17 R19 R20 R21 R22
12V: not fitted R?